# Altium schematic sheet encoder.SchDoc: Encoder
size A3; DrawnBy: Mogens Groth Nicolaisen; DocumentNumber: 7; SheetNumber: 7; SheetTotal: 7
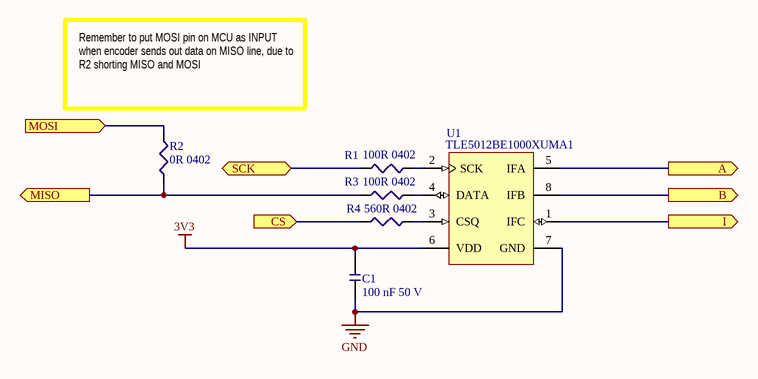
[diagram p0: encoder.SchDoc]

## Parts
C1  100 nF 50 V  [CAP_0402]
R1  100R 0402  [RES_0402]
R2  0R 0402  [RES_0402]
R3  560R 0402  [RES_0402]
R4  100R 0402  [RES_0402]
U1  TLE5012BE1000XUMA1  [INF-PG-DSO-8-16_M]

## Ports
A (out), B (out), CS (in), I (out), MISO (out), MOSI (in), SCK (bidir)

## Nets
3V3: C1.1 U1.6(VDD)
GND: C1.2 U1.7(GND)
A: U1.5(IFA) ; port A
B: U1.8(IFB) ; port B
CS: R4.1 ; port CS
I: U1.1(IFC) ; port I
MISO: R2.1 R3.1 ; port MISO
MOSI: R2.2 ; port MOSI
SCK: R1.1 ; port SCK
NetR1_2: R1.2 U1.2(SCK)
NetR3_2: R3.2 U1.4(DATA)
NetR4_2: R4.2 U1.3(CSQ)

## Notes on the sheet
- (near R2) Remember to put MOSI pin on MCU as INPUT when encoder sends out data on MISO line, due to R2 shorting MISO and MOSI
- ON Development
- Title:
- Size:
- A3
- Drawn By:
- Date:
- Sheet
- of
- Revision:

## Library data of the parts
C1 = CMP-00088-2: Multilayer Ceramic Capacitors MLCC - SMD/SMT .1uF 50Volts X7R +/-10% 0402 STD; Tolerance: 10%; Value: 100nF; Voltage: 50 V; Voltage Rating (DC): 50V; Capacitance: 100nF; Case/Package: 0402; Case Code (Imperial): 0402; Case Code (Metric): 1005; Dielectric: X7R; Halogen Free: Halogen Free; Height: 0.5mm; Lead Free: Lead Free; Length: 0.039inch; Max Operating Temperature: 125°C; Min Operating Temperature: -55°C; Mount: Surface Mount; Package Quantity: 10000; Packaging: Tape and Reel; Termination: SMD/SMT; Thickness: 0.022inch; Voltage Rating: 50V; Width: 0.5mm
R1 R4 = CMP-001-0001-5: 100R 1% 0402 63mW; Case/Package: 0402; Power: 63mW; Tolerance: 1%; Value: 100R
R2 = CMP-001-0055-1: RES SMD 0 OHM 1/16W 0402; Mfg. Part Number: RC0402JR-070RL; Power: 63mW; Case/Package: 0402; Tolerance: -; Value: 0R
R3 = CMP-001-0021-4: RES SMD 560 OHM 1% 1/16W 0402; Mfg. Part Number: RC1005F561CS; Case/Package: 0402; Power: 1/16 W; Tolerance: 1 %; Value: 560R
U1 = CMP-00121-2: Board Mount Hall Effect / Magnetic Sensors GMR Based Angle Sensor 6.5V; Operating Supply Voltage: 5V; Interface: SPI; Mount: Surface Mount; Case/Package: SMD/SMT; Number of Pins: 8; Min Operating Temperature: -40°C; Max Operating Temperature: 150°C; Lead Free: Lead Free; Halogen Free: Not Halogen Free